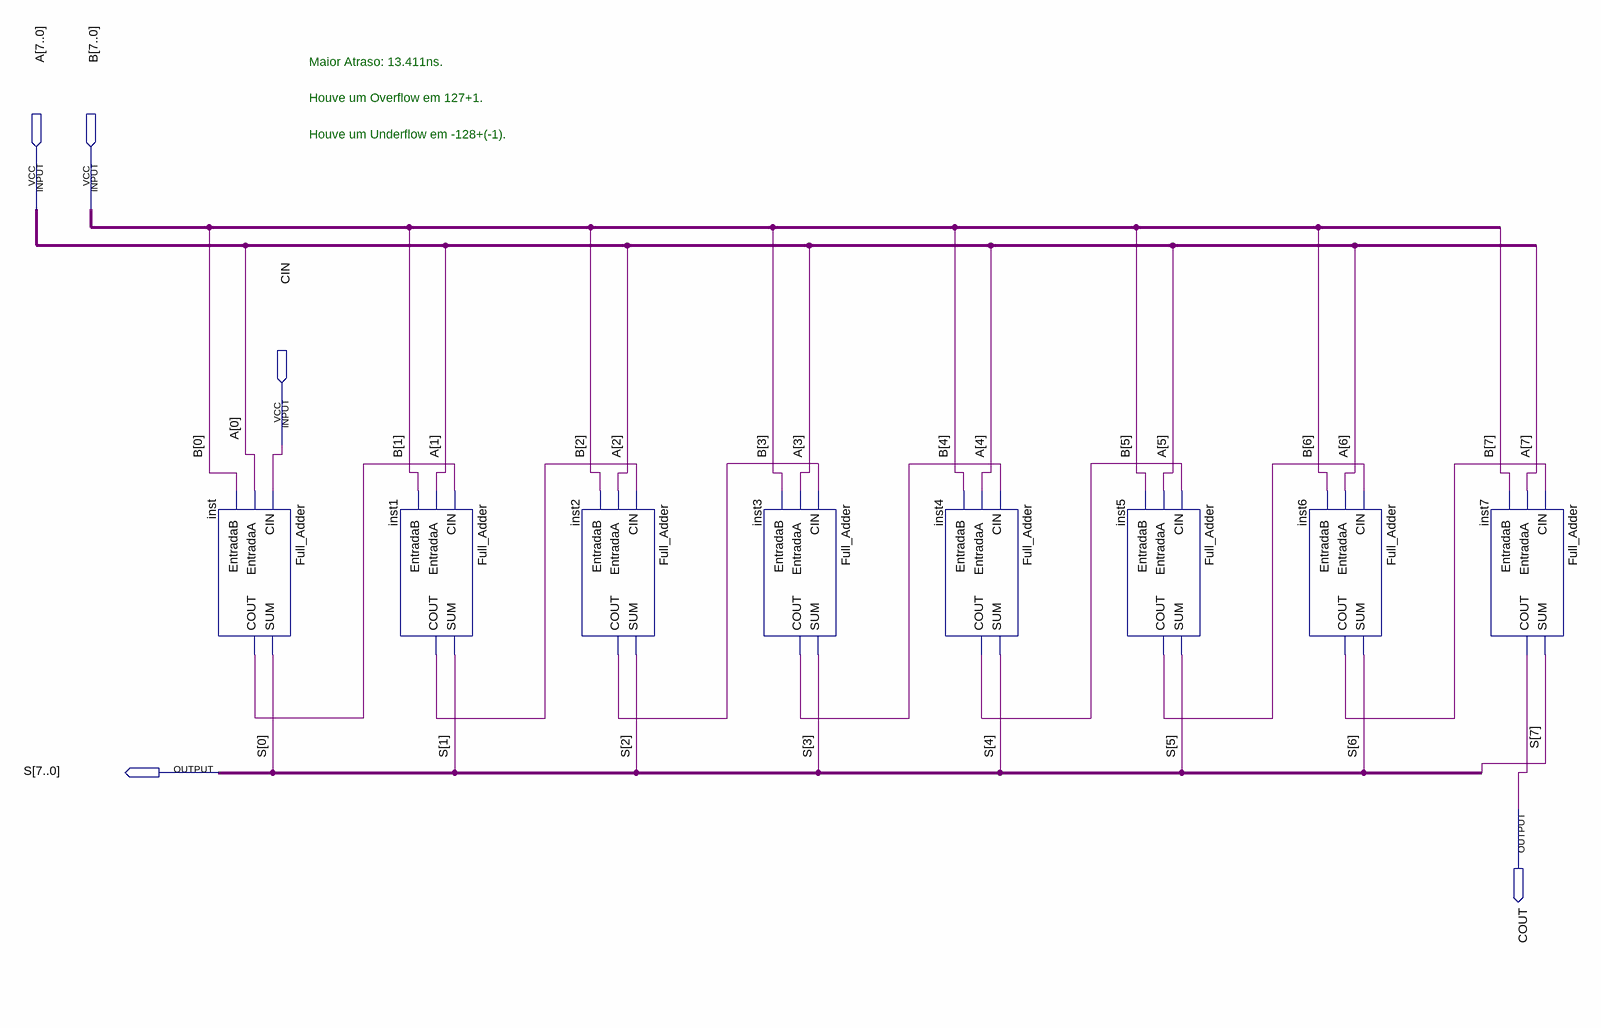
[diagram p0: schematic sheet]
// Quartus schematic FullAdder_8bit.bdf as structural Verilog: 8 symbols, 5 pins
module FullAdder_8bit (
  input  [7:0] A,
  input  [7:0] B,
  input  CIN,
  output [7:0] S,
  output COUT
);

  wire inst1_cout, inst2_cout, inst3_cout, inst4_cout, inst5_cout, inst6_cout, inst_cout;

  Full_Adder inst (.CIN(CIN), .EntradaA(A[0]), .EntradaB(B[0]), .SUM(S[0]), .COUT(inst_cout));
  Full_Adder inst1 (.CIN(inst_cout), .EntradaA(A[1]), .EntradaB(B[1]), .SUM(S[1]), .COUT(inst1_cout));
  Full_Adder inst2 (.CIN(inst1_cout), .EntradaA(A[2]), .EntradaB(B[2]), .SUM(S[2]), .COUT(inst2_cout));
  Full_Adder inst3 (.CIN(inst2_cout), .EntradaA(A[3]), .EntradaB(B[3]), .SUM(S[3]), .COUT(inst3_cout));
  Full_Adder inst4 (.CIN(inst3_cout), .EntradaA(A[4]), .EntradaB(B[4]), .SUM(S[4]), .COUT(inst4_cout));
  Full_Adder inst5 (.CIN(inst4_cout), .EntradaA(A[5]), .EntradaB(B[5]), .SUM(S[5]), .COUT(inst5_cout));
  Full_Adder inst6 (.CIN(inst5_cout), .EntradaA(A[6]), .EntradaB(B[6]), .SUM(S[6]), .COUT(inst6_cout));
  Full_Adder inst7 (.CIN(inst6_cout), .EntradaA(A[7]), .EntradaB(B[7]), .SUM(S[7]), .COUT(COUT));

  // Notes on the sheet:
  //   Maior Atraso: 13.411ns.
  //   Houve um Overflow em 127+1.
  //   Houve um Underflow em -128+(-1).
endmodule
